# EAGLE schematic PCB_V3 (EAGLE 7.7.0)
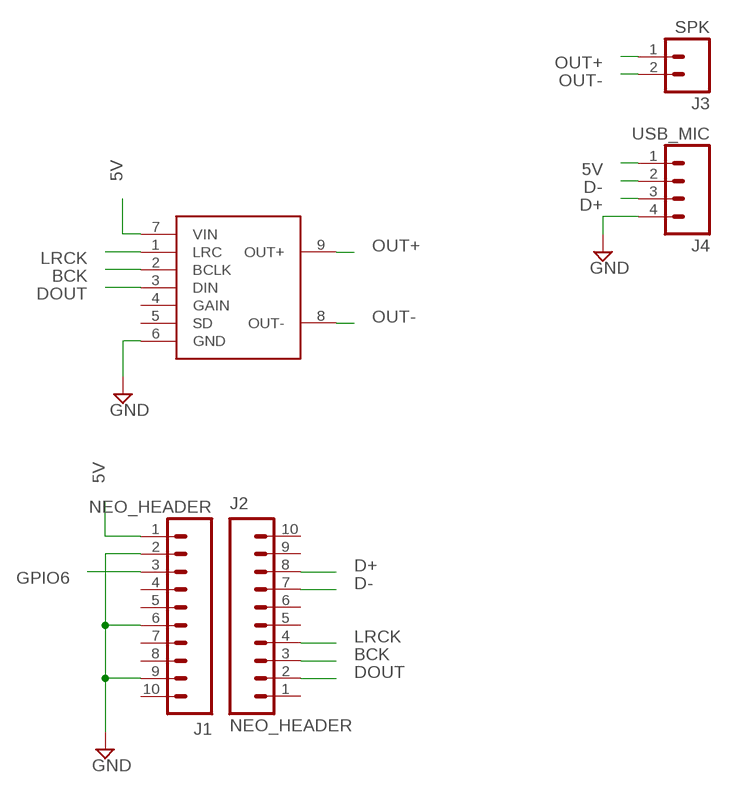
[diagram p0: schematic, sheet 1]

## Parts
J1  NEO_HEADER  M10NO_SILK_PTH_FEMALE  [1X10_NO_SILK]
J2  NEO_HEADER  M10NO_SILK_PTH_FEMALE  [1X10_NO_SILK]
J3  SPK  M021X02_NO_SILK  [1X02_NO_SILK]
J4  USB_MIC  M041X04_NO_SILK  [1X04_NO_SILK]
U$1  I2S_BREAKOUT  [I2S_BREAKOUT]

## Nets
5V: J1.1 J4.1 U$1.7(VIN)
BCK: J2.3 U$1.2(BCLK)
D+: J2.8 J4.3
D-: J2.7 J4.2
DOUT: J2.2 U$1.3(DIN)
GND: J1.2 J1.6 J1.9 J4.4 U$1.6(GND)
GPIO6: J1.3
LRCK: J2.4 U$1.1(LRC)
OUT+: J3.1 U$1.9(OUT+)
OUT-: J3.2 U$1.8(OUT-)
Unconnected: J1.4 J1.5 J1.7 J1.8 J1.10 J2.1 J2.5 J2.6 J2.9 J2.10 U$1.4(GAIN) U$1.5(SD)

## Library data of the parts
J1 J2 = SparkFun-Connectors:M10: Header 10 Standard 10-pin 0.1" header. Use with straight break away headers (SKU : PRT-00116), right angle break away headers (PRT-00553), swiss pins (PRT-00743), machine pins (PRT-00117), and female headers (PRT-00115).; PROD_ID: CONN-11563
J3 = SparkFun-Connectors:M02: Standard 2-pin 0.1" header. Use with - straight break away headers ( PRT-00116) - right angle break away headers (PRT-00553) - swiss pins (PRT-00743) - machine pins (PRT-00117) - female headers (PRT-00115) Molex polarized connector foot print use with: PRT-08233 with associated crimp pins and housings. 2.54_SCREWTERM for use with PRT-10571. 3.5mm Screw Terminal footprints for PRT-08084 5mm Screw Terminal footprints for use with PRT-08432
J4 = SparkFun-Connectors:M04: Header 4 Standard 4-pin 0.1" header. Use with straight break away headers (SKU : PRT-00116), right angle break away headers (PRT-00553), swiss pins (PRT-00743), machine pins (PRT-00117), and female headers (PRT-00115). Molex polarized connector foot print use with SKU : PRT-08231 with associated crimp pins and housings. 1MM SMD Version SKU: PRT-10208; PROD_ID: CONN-09696
U$1 = whisper_PCB:I2S_BREAKOUT